# Altium schematic sheet USBLCD_driver.SchDoc
size A2
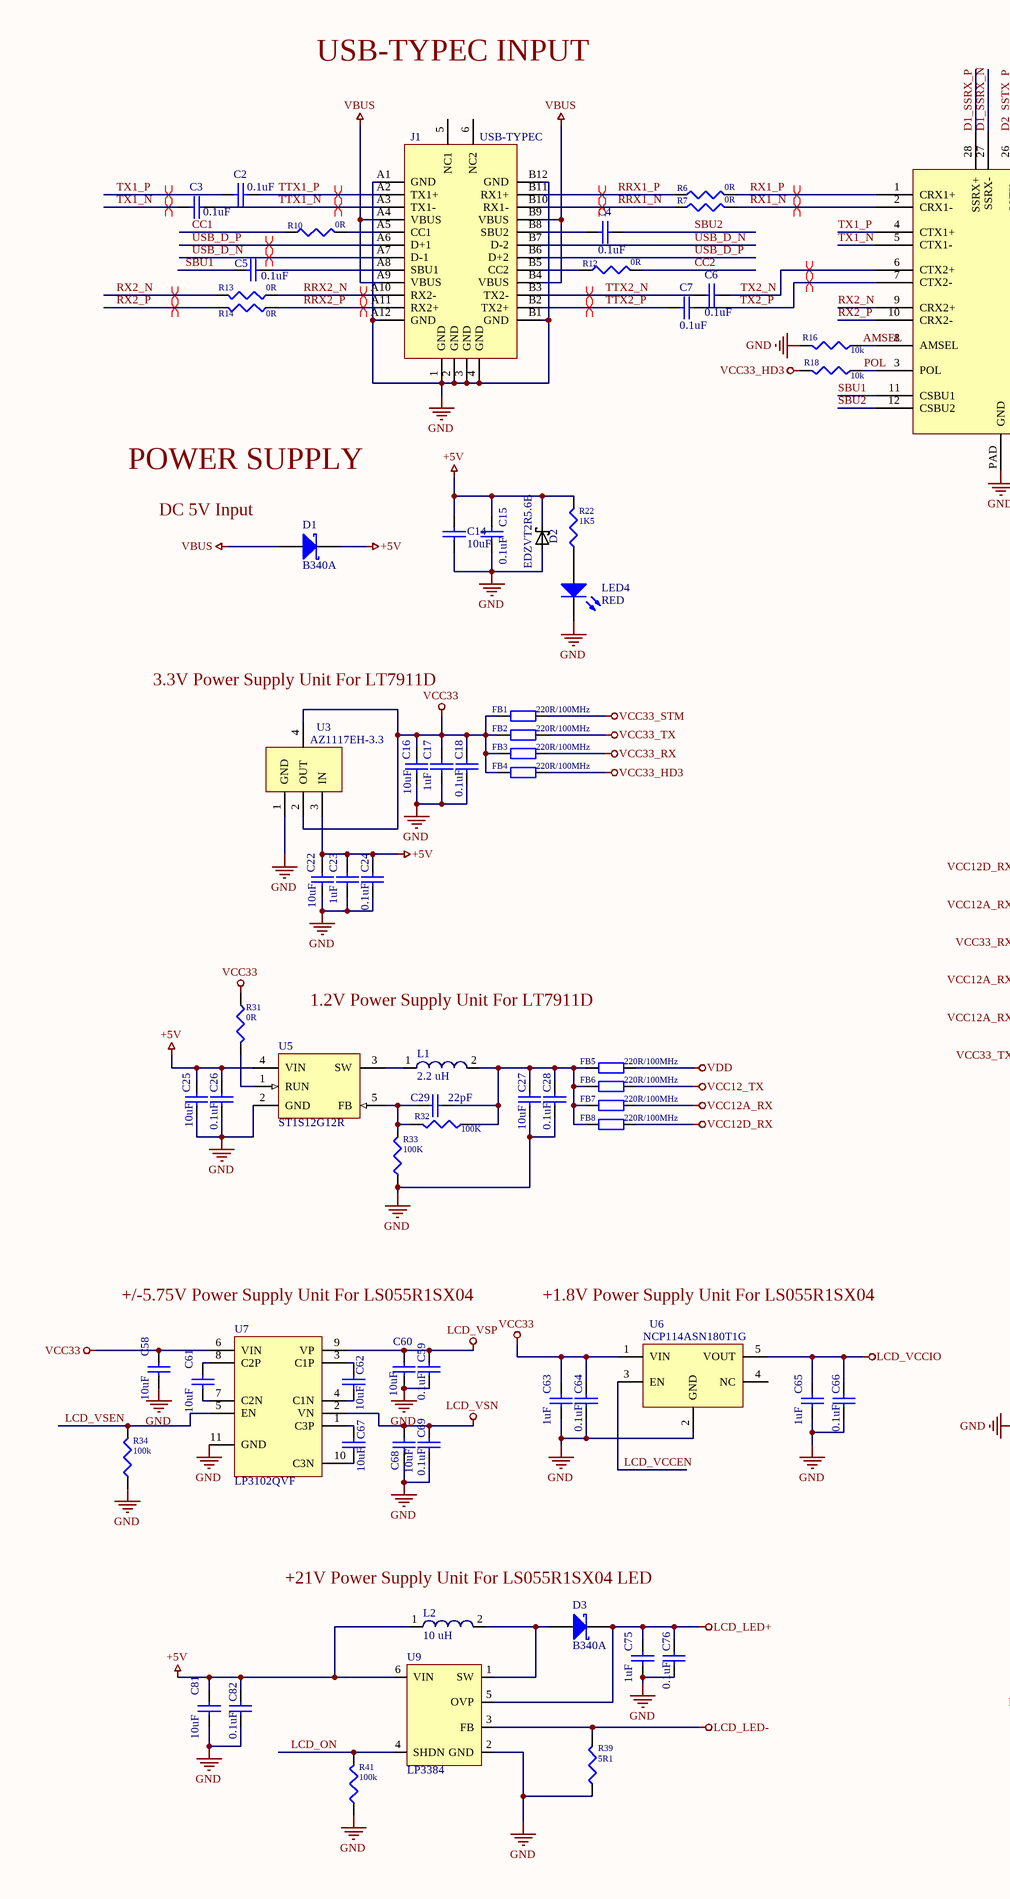
[diagram p0: USBLCD_driver.SchDoc, left]
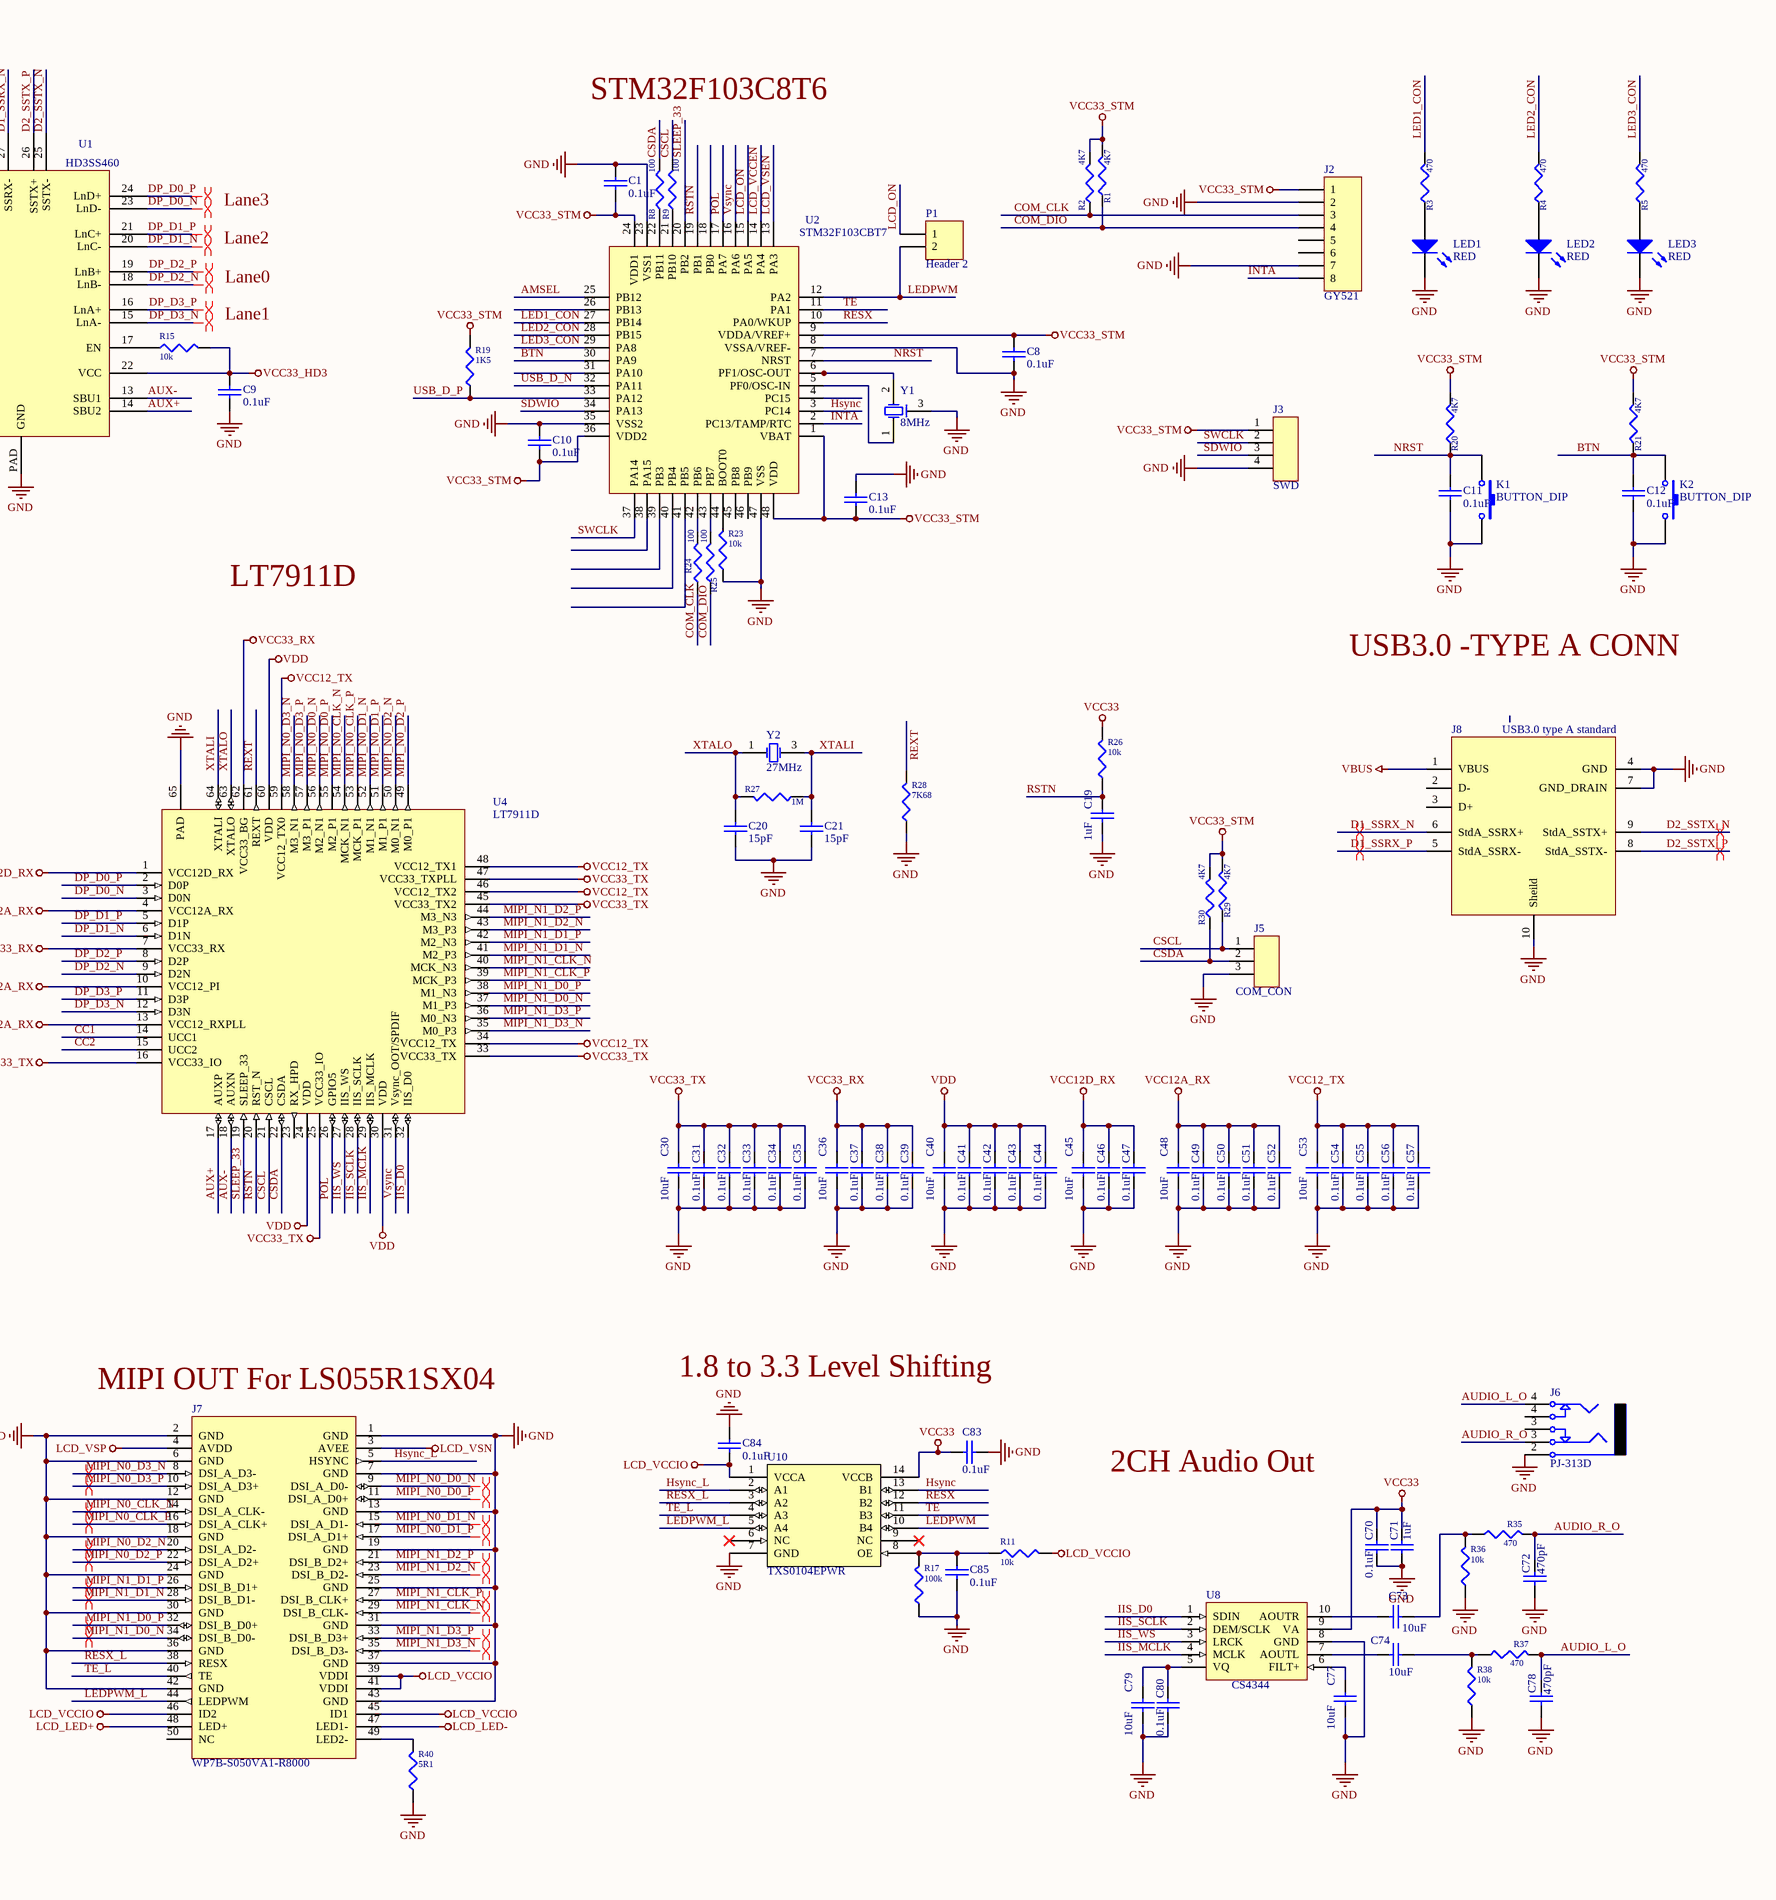
[diagram p1: USBLCD_driver.SchDoc, right]

## Parts
C1  0.1uF  [CAPACITOR_SMD_0402]
C2  0.1uF  [CAPACITOR_SMD_0201]
C3  0.1uF  [CAPACITOR_SMD_0201]
C4  0.1uF  [CAPACITOR_SMD_0201]
C5  0.1uF  [CAPACITOR_SMD_0201]
C6  0.1uF  [CAPACITOR_SMD_0201]
C7  0.1uF  [CAPACITOR_SMD_0201]
C8  0.1uF  [CAPACITOR_SMD_0402]
C9  0.1uF  [CAPACITOR_SMD_0402]
C10  0.1uF  [CAPACITOR_SMD_0402]
C11  0.1uF  [CAPACITOR_SMD_0402]
C12  0.1uF  [CAPACITOR_SMD_0402]
C13  0.1uF  [CAPACITOR_SMD_0402]
C14  10uF  [CAPACITOR_SMD_0603]
C15  0.1uF  [CAPACITOR_SMD_0402]
C16  10uF  [CAPACITOR_SMD_0603]
C17  1uF  [CAPACITOR_SMD_0402]
C18  0.1uF  [CAPACITOR_SMD_0402]
C19  1uF  [CAPACITOR_SMD_0402]
C20  15pF  [CAPACITOR_SMD_0402]
C21  15pF  [CAPACITOR_SMD_0402]
C22  10uF  [CAPACITOR_SMD_0603]
C23  1uF  [CAPACITOR_SMD_0402]
C24  0.1uF  [CAPACITOR_SMD_0402]
C25  10uF  [CAPACITOR_SMD_0603]
C26  0.1uF  [CAPACITOR_SMD_0402]
C27  10uF  [CAPACITOR_SMD_0603]
C28  0.1uF  [CAPACITOR_SMD_0402]
C29  22pF  [CAPACITOR_SMD_0402]
C30  10uF  [CAPACITOR_SMD_0603]
C31  0.1uF  [CAPACITOR_SMD_0402]
C32  0.1uF  [CAPACITOR_SMD_0402]
C33  0.1uF  [CAPACITOR_SMD_0402]
C34  0.1uF  [CAPACITOR_SMD_0402]
C35  0.1uF  [CAPACITOR_SMD_0402]
C36  10uF  [CAPACITOR_SMD_0603]
C37  0.1uF  [CAPACITOR_SMD_0402]
C38  0.1uF  [CAPACITOR_SMD_0402]
C39  0.1uF  [CAPACITOR_SMD_0402]
C40  10uF  [CAPACITOR_SMD_0603]
C41  0.1uF  [CAPACITOR_SMD_0402]
C42  0.1uF  [CAPACITOR_SMD_0402]
C43  0.1uF  [CAPACITOR_SMD_0402]
C44  0.1uF  [CAPACITOR_SMD_0402]
C45  10uF  [CAPACITOR_SMD_0603]
C46  0.1uF  [CAPACITOR_SMD_0402]
C47  0.1uF  [CAPACITOR_SMD_0402]
C48  10uF  [CAPACITOR_SMD_0603]
C49  0.1uF  [CAPACITOR_SMD_0402]
C50  0.1uF  [CAPACITOR_SMD_0402]
C51  0.1uF  [CAPACITOR_SMD_0402]
C52  0.1uF  [CAPACITOR_SMD_0402]
C53  10uF  [CAPACITOR_SMD_0603]
C54  0.1uF  [CAPACITOR_SMD_0402]
C55  0.1uF  [CAPACITOR_SMD_0402]
C56  0.1uF  [CAPACITOR_SMD_0402]
C57  0.1uF  [CAPACITOR_SMD_0402]
C58  10uF  [CAPACITOR_SMD_0603]
C59  0.1uF  [CAPACITOR_SMD_0402]
C60  10uF  [CAPACITOR_SMD_0603]
C61  10uF  [CAPACITOR_SMD_0603]
C62  10uF  [CAPACITOR_SMD_0603]
C63  1uF  [CAPACITOR_SMD_0402]
C64  0.1uF  [CAPACITOR_SMD_0402]
C65  1uF  [CAPACITOR_SMD_0402]
C66  0.1uF  [CAPACITOR_SMD_0402]
C67  10uF  [CAPACITOR_SMD_0603]
C68  10uF  [CAPACITOR_SMD_0603]
C69  0.1uF  [CAPACITOR_SMD_0402]
C70  0.1uF  [CAPACITOR_SMD_0402]
C71  1uF  [CAPACITOR_SMD_0402]
C72  470pF  [CAPACITOR_SMD_0402]
C73  10uF  [CAPACITOR_SMD_0603]
C74  10uF  [CAPACITOR_SMD_0603]
C75  1uF  [CAPACITOR_SMD_0402]
C76  0.1uF  [CAPACITOR_SMD_0402]
C77  10uF  [CAPACITOR_SMD_0603]
C78  470pF  [CAPACITOR_SMD_0402]
C79  10uF  [CAPACITOR_SMD_0603]
C80  0.1uF  [CAPACITOR_SMD_0402]
C81  10uF  [CAPACITOR_SMD_0603]
C82  0.1uF  [CAPACITOR_SMD_0402]
C83  0.1uF  [CAPACITOR_SMD_0402]
C84  0.1uF  [CAPACITOR_SMD_0402]
C85  0.1uF  [CAPACITOR_SMD_0402]
D1  B340A  [DO-214AC]
D2  EDZVT2R5.6B  [SOD128]
D3  B340A  [DO-214AC]
FB1  220R/100MHz  [SMD_0603]
FB2  220R/100MHz  [SMD_0603]
FB3  220R/100MHz  [SMD_0603]
FB4  220R/100MHz  [SMD_0603]
FB5  220R/100MHz  [SMD_0603]
FB6  220R/100MHz  [SMD_0603]
FB7  220R/100MHz  [SMD_0603]
FB8  220R/100MHz  [SMD_0603]
J1  USB-TYPEC  [USB_TYPEC_RECEPTACLE_DIP]
J2  GY521  [HDR1X8]
J3  SWD  [Header-Female-2.54*4]
J5  COM_CON  [Header-Female-2.54*3]
J6  PJ-313D  [WQP-PJ313D]
J7  WP7B-S050VA1-R8000  [WP7B-S050VA1-R500]
J8  USB3.0 type A standard  [USB type A female connector]
K1  BUTTON_DIP  [Push button_mini(2 pin)]
K2  BUTTON_DIP  [Push button_mini(2 pin)]
L1  2.2 uH  [WE-LQS 3015]
L2  10 uH  [WE-LQS 4018]
LED1  RED  [SMD_LED(0603)]
LED2  RED  [SMD_LED(0603)]
LED3  RED  [SMD_LED(0603)]
LED4  RED  [SMD_LED(0603)]
P1  Header 2  [HDR1X2]
R1  4K7  [RESISTOR_SMD_0402]
R2  4K7  [RESISTOR_SMD_0402]
R3  470  [RESISTOR_SMD_0402]
R4  470  [RESISTOR_SMD_0402]
R5  470  [RESISTOR_SMD_0402]
R6  0R  [RESISTOR_SMD_0201]
R7  0R  [RESISTOR_SMD_0201]
R8  100  [RESISTOR_SMD_0402]
R9  100  [RESISTOR_SMD_0402]
R10  0R  [RESISTOR_SMD_0201]
R11  10k  [RESISTOR_SMD_0402]
R12  0R  [RESISTOR_SMD_0201]
R13  0R  [RESISTOR_SMD_0201]
R14  0R  [RESISTOR_SMD_0201]
R15  10k  [RESISTOR_SMD_0402]
R16  10k  [RESISTOR_SMD_0402]
R17  100k  [RESISTOR_SMD_0402]
R18  10k  [RESISTOR_SMD_0402]
R19  1K5  [RESISTOR_SMD_0402]
R20  4K7  [RESISTOR_SMD_0402]
R21  4K7  [RESISTOR_SMD_0402]
R22  1K5  [RESISTOR_SMD_0402]
R23  10k  [RESISTOR_SMD_0402]
R24  100  [RESISTOR_SMD_0402]
R25  100  [RESISTOR_SMD_0402]
R26  10k  [RESISTOR_SMD_0402]
R27  1M  [RESISTOR_SMD_0402]
R28  7K68  [RESISTOR_SMD_0402]
R29  4K7  [RESISTOR_SMD_0402]
R30  4K7  [RESISTOR_SMD_0402]
R31  0R  [RESISTOR_SMD_0201]
R32  100K  [RESISTOR_SMD_0402]
R33  100K  [RESISTOR_SMD_0402]
R34  100k  [RESISTOR_SMD_0402]
R35  470  [RESISTOR_SMD_0402]
R36  10k  [RESISTOR_SMD_0402]
R37  470  [RESISTOR_SMD_0402]
R38  10k  [RESISTOR_SMD_0402]
R39  5R1  [RESISTOR_SMD_0402]
R40  5R1  [RESISTOR_SMD_0402]
R41  100k  [RESISTOR_SMD_0402]
U1  HD3SS460  [WQFN28-0.8mm]
U2  STM32F103CBT7  [LQFP48-7mm*7mm]
U3  AZ1117EH-3.3  [SOT223_N]
U4  LT7911D  [QFN64-7.5mm*7.5mm]
U5  ST1S12G12R  [SOT23 - 5]
U6  NCP114ASN180T1G  [SOT23 - 5]
U7  LP3102QVF  [TDFN-10]
U8  CS4344  [10LD TSSOP(3mm BODY)]
U9  LP3384  [SOT95P279X130-6N]
U10  TXS0104EPWR  [PW14]
Y1  8MHz  [Resonator_mini]
Y2  27MHz  [Crystal resonator]

## Nets
+5V: C14.1 C15.1 C22.1 C23.1 C24.1 C25.1 C26.1 C81.1 C82.1 D1.1(K) D2.1(K) L2.1 R22.2 U3.3(IN) U5.4(VIN) U9.6(VIN)
GND: C1.1 C8.2 C9.2 C10.1 C11.2 C12.2 C13.1 C14.2 C15.2 C16.2 C17.2 C18.2 C19.2 C20.2 C21.2 C22.2 C23.2 C24.2 C25.2 C26.2 C27.2 C28.2 C30.2 C31.2 C32.2 C33.2 C34.2 C35.2 C36.2 C37.2 C38.2 C39.2 C40.2 C41.2 C42.2 C43.2 C44.2 C45.2 C46.2 C47.2 C48.2 C49.2 C50.2 C51.2 C52.2 C53.2 C54.2 C55.2 C56.2 C57.2 C58.2 C59.2 C60.2 C63.2 C64.2 C65.2 C66.2 C68.2 C69.2 C70.2 C71.2 C72.2 C75.2 C76.2 C77.2 C78.2 C79.2 C80.2 C81.2 C82.2 C83.2 C84.2 C85.2 D2.2(A) J1.1(GND) J1.2(GND) J1.3(GND) J1.4(GND) J1.A1(GND) J1.A12(GND) J1.B1(GND) J1.B12(GND) J2.2 J2.7 J3.4 J5.3 J6.2 J7.1(GND) J7.2(GND) J7.6(GND) J7.7(GND) J7.12(GND) J7.13(GND) J7.18(GND) J7.19(GND) J7.24(GND) J7.25(GND) J7.30(GND) J7.31(GND) J7.36(GND) J7.37(GND) J7.42(GND) J7.43(GND) J8.4(GND) J8.7(GND_DRAIN) J8.10(Sheild) K1.2 K2.2 LED1.2(K) LED2.2(K) LED3.2(K) LED4.2(K) R16.2 R17.1 R23.1 R28.1 R33.1 R34.1 R36.1 R38.1 R39.1 R40.1 R41.1 U1.PAD(GND) U2.8(VSSA/VREF-) U2.23(VSS1) U2.35(VSS2) U2.47(VSS) U3.1(GND) U4.65(PAD) U5.2(GND) U6.2(GND) U7.11(GND) U8.8(GND) U9.2(GND) U10.7(GND) Y1.3(OSC2)
LCD_LED+: C75.1 C76.1 D3.1(K) J7.48(LED+) U9.5(OVP)
LCD_LED-: J7.47(LED1-) R39.2 U9.3(FB)
LCD_VCCIO: C65.1 C66.1 C84.1 J7.39(VDDI) J7.41(VDDI) J7.45(ID1) J7.46(ID2) R11.2 U6.5(VOUT) U10.1(VCCA)
LCD_VSN: C68.1 C69.1 J7.3(AVEE) U7.2(VN)
LCD_VSP: C59.1 C60.1 J7.4(AVDD) U7.9(VP)
VBUS: D1.2(A) J1.A4(VBUS) J1.A9(VBUS) J1.B4(VBUS) J1.B9(VBUS) J8.1(VBUS)
VCC12_TX: C53.1 C54.1 C55.1 C56.1 C57.1 FB6.2 U4.34(VCC12_TX) U4.46(VCC12_TX2) U4.48(VCC12_TX1) U4.59(VCC12_TX0)
VCC12A_RX: C48.1 C49.1 C50.1 C51.1 C52.1 FB7.2 U4.4(VCC12A_RX) U4.10(VCC12_PI) U4.13(VCC12_RXPLL)
VCC12D_RX: C45.1 C46.1 C47.1 FB8.2 U4.1(VCC12D_RX)
VCC33: C16.1 C17.1 C18.1 C58.1 C63.1 C64.1 C70.1 C71.1 C83.1 FB1.1 FB2.1 FB3.1 FB4.1 R26.2 R31.1 U3.2(OUT) U3.4(OUT) U6.1(VIN) U7.6(VIN) U8.9(VA) U10.14(VCCB)
VCC33_HD3: C9.1 FB4.2 R15.2 R18.2 U1.22(VCC)
VCC33_RX: C36.1 C37.1 C38.1 C39.1 FB3.2 U4.7(VCC33_RX) U4.62(VCC33_BG)
VCC33_STM: C1.2 C8.1 C10.2 C13.2 FB1.2 J2.1 J3.1 R1.2 R2.2 R19.2 R20.2 R21.2 R29.2 R30.2 U2.1(VBAT) U2.9(VDDA/VREF+) U2.24(VDD1) U2.36(VDD2) U2.48(VDD)
VCC33_TX: C30.1 C31.1 C32.1 C33.1 C34.1 C35.1 FB2.2 U4.16(VCC33_IO) U4.25(VCC33_IO) U4.33(VCC33_TX) U4.45(VCC33_TX2) U4.47(VCC33_TXPLL)
VDD: C40.1 C41.1 C42.1 C43.1 C44.1 FB5.2 U4.24(VDD) U4.30(VDD) U4.60(VDD)
AMSEL: R16.1 U1.8(AMSEL) U2.25(PB12)
AUDIO_L_O: C78.1 J6.4 R37.2
AUDIO_R_O: C72.1 J6.3 R35.2
AUX+: U1.14(SBU2) U4.17(AUXP)
AUX-: U1.13(SBU1) U4.18(AUXN)
BTN: C12.1 K2.1 R21.1 U2.30(PA9)
CC1: R10.1 U4.14(UCC1)
CC2: R12.2 U4.15(UCC2)
COM_CLK: J2.3 R2.1 R24.1
COM_DIO: J2.4 R1.1 R25.1
CSCL: J5.1 R9.2 R29.1 U4.21(CSCL)
CSDA: J5.2 R8.2 R30.1 U4.22(CSDA)
D1_SSRX_N: J8.6(StdA_SSRX+) U1.27(SSRX-)
D1_SSRX_P: J8.5(StdA_SSRX-) U1.28(SSRX+)
D2_SSTX_N: J8.9(StdA_SSTX+) U1.25(SSTX-)
D2_SSTX_P: J8.8(StdA_SSTX-) U1.26(SSTX+)
DP_D0_N: U1.23(LnD-) U4.3(D0N)
DP_D0_P: U1.24(LnD+) U4.2(D0P)
DP_D1_N: U1.20(LnC-) U4.6(D1N)
DP_D1_P: U1.21(LnC+) U4.5(D1P)
DP_D2_N: U1.18(LnB-) U4.9(D2N)
DP_D2_P: U1.19(LnB+) U4.8(D2P)
DP_D3_N: U1.15(LnA-) U4.12(D3N)
DP_D3_P: U1.16(LnA+) U4.11(D3P)
Hsync: U2.3(PC14) U10.13(B1)
Hsync_L: J7.5(HSYNC) U10.2(A1)
IIS_D0: U4.32(IIS_D0) U8.1(SDIN)
IIS_MCLK: U4.29(IIS_MCLK) U8.4(MCLK)
IIS_SCLK: U4.28(IIS_SCLK) U8.2(DEM/SCLK)
IIS_WS: U4.27(IIS_WS) U8.3(LRCK)
INTA: J2.8 U2.2(PC13/TAMP/RTC)
LCD_ON: P1.1 R41.2 U2.15(PA5) U9.4(SHDN)
LCD_VCCEN: U2.14(PA4) U6.3(EN)
LCD_VSEN: R34.2 U2.13(PA3) U7.5(EN)
LED1_CON: R3.2 U2.27(PB14)
LED2_CON: R4.2 U2.28(PB15)
LED3_CON: R5.2 U2.29(PA8)
LEDPWM: P1.2 U2.12(PA2) U10.10(B4)
LEDPWM_L: J7.44(LEDPWM) U10.5(A4)
MIPI_N0_CLK_N: J7.14(DSI_A_CLK-) U4.54(MCK_N1)
MIPI_N0_CLK_P: J7.16(DSI_A_CLK+) U4.53(MCK_P1)
MIPI_N0_D0_N: J7.9(DSI_A_D0-) U4.56(M2_N1)
MIPI_N0_D0_P: J7.11(DSI_A_D0+) U4.55(M2_P1)
MIPI_N0_D1_N: J7.15(DSI_A_D1-) U4.52(M1_N1)
MIPI_N0_D1_P: J7.17(DSI_A_D1+) U4.51(M1_P1)
MIPI_N0_D2_N: J7.20(DSI_A_D2-) U4.50(M0_N1)
MIPI_N0_D2_P: J7.22(DSI_A_D2+) U4.49(M0_P1)
MIPI_N0_D3_N: J7.8(DSI_A_D3-) U4.58(M3_N1)
MIPI_N0_D3_P: J7.10(DSI_A_D3+) U4.57(M3_P1)
MIPI_N1_CLK_N: J7.29(DSI_B_CLK-) U4.40(MCK_N3)
MIPI_N1_CLK_P: J7.27(DSI_B_CLK+) U4.39(MCK_P3)
MIPI_N1_D0_N: J7.34(DSI_B_D0-) U4.37(M1_P3)
MIPI_N1_D0_P: J7.32(DSI_B_D0+) U4.38(M1_N3)
MIPI_N1_D1_N: J7.28(DSI_B_D1-) U4.41(M2_P3)
MIPI_N1_D1_P: J7.26(DSI_B_D1+) U4.42(M2_N3)
MIPI_N1_D2_N: J7.23(DSI_B_D2-) U4.43(M3_P3)
MIPI_N1_D2_P: J7.21(DSI_B_D2+) U4.44(M3_N3)
MIPI_N1_D3_N: J7.35(DSI_B_D3-) U4.35(M0_P3)
MIPI_N1_D3_P: J7.33(DSI_B_D3+) U4.36(M0_N3)
NRST: C11.1 K1.1 R20.1 U2.7(NRST)
POL: R18.1 U1.3(POL) U2.17(PA7) U4.26(GPIO5)
RESX: U2.10(PA0/WKUP) U10.12(B2)
RESX_L: J7.38(RESX) U10.3(A2)
REXT: R28.2 U4.61(REXT)
RRX1_N: J1.B10(RX1-) R7.1
RRX1_P: J1.B11(RX1+) R6.1
RRX2_N: J1.A10(RX2-) R13.1
RRX2_P: J1.A11(RX2+) R14.1
RSTN: C19.1 R26.1 U2.19(PB1) U4.20(RST_N)
RX1_N: R7.2 U1.2(CRX1-)
RX1_P: R6.2 U1.1(CRX1+)
RX2_N: R13.2 U1.9(CRX2+)
RX2_P: R14.2 U1.10(CRX2-)
SBU1: C5.2 U1.11(CSBU1)
SBU2: C4.1 U1.12(CSBU2)
SDWIO: J3.3 U2.34(PA13)
SLEEP_33: U2.20(PB2) U4.19(SLEEP_33)
SWCLK: J3.2 U2.37(PA14)
TE: U2.11(PA1) U10.11(B3)
TE_L: J7.40(TE) U10.4(A3)
TTX1_N: C3.1 J1.A3(TX1-)
TTX1_P: C2.1 J1.A2(TX1+)
TTX2_N: C6.2 J1.B3(TX2-)
TTX2_P: C7.2 J1.B2(TX2+)
TX1_N: C3.2 U1.5(CTX1-)
TX1_P: C2.2 U1.4(CTX1+)
TX2_N: C6.1 U1.6(CTX2+)
TX2_P: C7.1 U1.7(CTX2-)
USB_D_N: J1.A7(D-1) J1.B7(D-2) U2.32(PA11)
USB_D_P: J1.A6(D+1) J1.B6(D+2) R19.1 U2.33(PA12)
Vsync: U2.16(PA6) U4.31(Vsync_OOT/SPDIF)
XTALI: C21.1 R27.1 U4.64(XTALI) Y2.3(OSC2)
XTALO: C20.1 R27.2 U4.63(XTALO) Y2.1(OSC1)
NetC4_2: C4.2 J1.B8(SBU2)
NetC5_1: C5.1 J1.A8(SBU1)
NetC27_1: C27.1 C28.1 C29.2 FB5.1 FB6.1 FB7.1 FB8.1 L1.2 R32.1
NetC29_1: C29.1 R32.2 R33.2 U5.5(FB)
NetC61_1: C61.1 U7.8(C2P)
NetC61_2: C61.2 U7.7(C2N)
NetC62_1: C62.1 U7.3(C1P)
NetC62_2: C62.2 U7.4(C1N)
NetC67_1: C67.1 U7.1(C3P)
NetC67_2: C67.2 U7.10(C3N)
NetC73_1: C73.1 U8.10(AOUTR)
NetC73_2: C73.2 R35.1 R36.2
NetC74_1: C74.1 U8.7(AOUTL)
NetC74_2: C74.2 R37.1 R38.2
NetC77_1: C77.1 U8.6(FILT+)
NetC79_1: C79.1 C80.1 U8.5(VQ)
NetC85_1: C85.1 R11.1 R17.2 U10.8(OE)
NetD3_2: D3.2(A) L2.2 U9.1(SW)
NetJ1_A5: J1.A5(CC1) R10.2
NetJ1_B5: J1.B5(CC2) R12.1
NetJ7_49: J7.49(LED2-) R40.2
NetL1_1: L1.1 U5.3(SW)
NetLED1_1: LED1.1(A) R3.1
NetLED2_1: LED2.1(A) R4.1
NetLED3_1: LED3.1(A) R5.1
NetLED4_1: LED4.1(A) R22.1
NetR8_1: R8.1 U2.22(PB11)
NetR9_1: R9.1 U2.21(PB10)
NetR15_1: R15.1 U1.17(EN)
NetR23_2: R23.2 U2.44(BOOT0)
NetR24_2: R24.2 U2.42(PB6)
NetR25_2: R25.2 U2.43(PB7)
NetR31_2: R31.2 U5.1(RUN)
NetU2_5: U2.5(PF0/OSC-IN) Y1.1(OSC1)
NetU2_6: U2.6(PF1/OSC-OUT) Y1.2(OSC2)

Not connected (* = marked no-connect by the designer): J1 5(NC1) 6(NC2); J2 5 6; J7 50(NC); J8 2(D-) 3(D+); U2 4(PC15) 18(PB0) 26(PB13) 31(PA10) 38(PA15) 39(PB3) 40(PB4) 41(PB5) 45(PB8) 46(PB9); U4 23(RX_HPD); U6 4(NC); U10 6(NC)* 9(NC)*

## Layout directives
differential pair: D1_SSRX_N, D1_SSRX_P, D2_SSTX_N, D2_SSTX_P, DP_D0_N, DP_D0_P, DP_D1_N, DP_D1_P, DP_D2_N, DP_D2_P, DP_D3_N, DP_D3_P, MIPI_N0_CLK_N, MIPI_N0_CLK_P, MIPI_N0_D0_N, MIPI_N0_D0_P, MIPI_N0_D1_N, MIPI_N0_D1_P, MIPI_N0_D2_N, MIPI_N0_D2_P, MIPI_N0_D3_N, MIPI_N0_D3_P, MIPI_N1_CLK_N, MIPI_N1_CLK_P, MIPI_N1_D0_N, MIPI_N1_D0_P, MIPI_N1_D1_N, MIPI_N1_D1_P, MIPI_N1_D2_N, MIPI_N1_D2_P, MIPI_N1_D3_N, MIPI_N1_D3_P, RRX1_N, RRX1_P, RRX2_N, RRX2_P, RX1_N, RX1_P, RX2_N, RX2_P, TTX1_N, TTX1_P, TTX2_N, TTX2_P, TX1_N, TX1_P, TX2_N, TX2_P, USB_D_N, USB_D_P

## Notes on the sheet
- USB-TYPEC INPUT
- STM32F103C8T6
- Lane3
- Lane2
- Lane0
- (near R15) Lane1
- POWER SUPPLY
- DC 5V Input
- LT7911D
- 3.3V Power Supply Unit For LT7911D
- USB3.0 -TYPE A CONN
- 1.2V Power Supply Unit For LT7911D
- +/-5.75V Power Supply Unit For LS055R1SX04
- +1.8V Power Supply Unit For LS055R1SX04
- (near J7) MIPI OUT For LS055R1SX04
- 1.8 to 3.3 Level Shifting
- 2CH Audio Out
- +21V Power Supply Unit For LS055R1SX04 LED

## Library data of the parts
C1 C8-C13 C15 C18 C24 C26 C28 C31-C35 C37-C39 C41-C44 C46 C47 C49-C52 C54-C57 C59 C64 C66 C69 C70 C76 C80 C82-C85 = CAP_0402_100n: CAP CER 0.1UF 16V X7R 0402; Manufacturer: Murata Electronics North America; Manufacturer Part Number: GRM155R71C104KA88D; Digikey Code: 490-3261-1-ND; Value: 0.1uF
C2-C7 = CAP_0201_100n: CAP CER 0.1UF 10V X5R 0201; Manufacturer: Murata Electronics North America; Manufacturer Part Number: GRM033R61A104KE15D; Digikey Code: 490-5881-1-ND; Value: 0.1uF
C14 C16 C22 C25 C27 C30 C36 C40 C45 C48 C53 C58 C60-C62 C67 C68 C73 C74 C77 C79 C81 = CAP_0603_1u: CAP CER 1UF 16V X5R 0603; Manufacturer: Murata Electronics North America; Manufacturer Part Number: GRM188R61C105KA12D; Digikey Code: 490-10479-1-ND; Value: 10uF
C17 C19-C21 C23 C29 C63 C65 C71 C72 C75 C78 = CAP_0402_10u: CAP CER 10UF 4V X5R 0402; Manufacturer: Murata Electronics North America; Manufacturer Part Number: GRM155R60G106ME44D; Digikey Code: 490-10693-1-ND
  C17 C19 C23 C63 C65 C71 C75: Value: 1uF
  C20 C21: Value: 15pF
  C29: Value: 22pF
  C72 C78: Value: 470pF
D1 D3 = Diode 10TQ035: Schottky Rectifier; Note: Terminal 2 is the TAB and is electrically connected to the cathode; Published: 8-Jun-2000; LatestRevisionDate: 17-Jul-2002; LatestRevisionNote: Re-released for DXP Platform.; DatasheetVersion: PD-2.057B; PackageVersion: Feb-1998; PackageReference: TO-220AC; Publisher: Altium Limited; PackageDescription: TO, Thru-Hole, Vertical, Heatsink Mounted; 3 In-Line Leads (1 Absent); Pitch 2.54 mm; ComponentLink1Description: Manufacturer Link; ComponentLink1URL: http://www.irf.com/; ComponentLink2Description: Datasheet; ComponentLink2URL: http://www.irf.com/product-info/datasheets/data/10tq.pdf
D2 = BAT46W: MF: Diotec; Availability: Unavailable; SnapEDA_Link: https://www.snapeda.com/parts/BAT46W/Diotec/view-part/?ref=snap; MP: BAT46W; Price: None; Package: SOD-123 Diotec; Value: *
FB1-FB8 = Res2: Ferrite Bead(0603); Published: 8-Jun-2000; LatestRevisionDate: 17-Jul-2002; LatestRevisionNote: Re-released for DXP Platform.; PackageReference: AXIAL-0.4; Publisher: Altium Limited; PackageDescription: Axial Device, Thru-Hole; 2 Leads; 0.4 in Pin Spacing
J1 = USB-TYPEC: USB-TYPE C Receptable DIP Connector
J2 = Header 8: Header, 8-Pin; LatestRevisionDate: 17-Jul-2002; LatestRevisionNote: Re-released for DXP Platform.; Publisher: Altium Limited
J3 = 4PinConnector
J5 = 3PinConnector
J6 = WPQ-PJ313D: Connector, 3.5mm Stereo Audio Socket, Black
J7 = LS055R1SX04: WP7B-S050VA1-R8000 / LCD Connector for LS055R1SX04
J8 = USB3.0 type A standard: 9Pin DIP USB3.0 type A female Connector
K1 K2 = SW-PB: 2 Pin Mini Push Button Switch; Published: 24-Mar-1999; LatestRevisionDate: 17-Jul-2002; LatestRevisionNote: Re-released for DXP Platform.; PackageReference: SPST-2; Publisher: Altium Limited; PackageDescription: Switch; 2 Leads
L1 = CMP-1354-00022-1: SMD Power Inductor, L=2.2 µH 1.5A 72mOhm; PartNumber: NR3015T2R2M; Manufacturer: Taiyo Yuden; Inductance: 2.2 ÂµH; ComponentLink2URL: http://katalog.we-online.de/pbs/datasheet/74404032022.pdf; ComponentLink1URL: http://www.we-online.com; ComponentLink2Description: Datasheet; ComponentLink1Description: Manufacturer URL; PackageReference: WE-LQS 3015
L2 = CMP-1354-00028-1: WE-LQS SMD Power Inductor, L=10 µH; PartNumber: NRS4018T100MDGJ; Manufacturer: Taiyo Yuden; Inductance: 10 ÂµH; ComponentLink2URL: http://katalog.we-online.de/pbs/datasheet/74404042100.pdf; ComponentLink2Description: Datasheet; PackageReference: WE-LQS 4018; ComponentLink1URL: http://www.we-online.com; ComponentLink1Description: Manufacturer URL
LED1-LED4 = LED1: Typical RED GaAs LED; Published: Yellow; LatestRevisionDate: 08-Jul-2005; LatestRevisionNote: Mech Layer 1 removed.; PackageReference: LED-1; Publisher: Altium Limited; PackageDescription: LED; 2 Leads
P1 = Header 2: Header, 2-Pin; LatestRevisionDate: 17-Jul-2002; LatestRevisionNote: Re-released for DXP Platform.; Publisher: Altium Limited
R1-R5 R8 R9 R11 R15-R30 R32-R38 R41 = RES_0402_3K3: RES SMD 3.3K OHM 1% 1/10W 0402; Manufacturer: Panasonic Electronic Components; Manufacturer Part Number: ERJ-2RKF3301X; Digikey Code: P3.30KLTR-ND
  R1 R2 R20 R21 R29 R30: Value: 4K7
  R3-R5 R35 R37: Value: 470
  R8 R9 R24 R25: Value: 100
  R11 R15 R16 R18 R23 R26 R36 R38: Value: 10k
  R17 R34 R41: Value: 100k
  R19 R22: Value: 1K5
  R27: Value: 1M
  R28: Value: 7K68
  R32 R33: Value: 100K
R6 R7 R10 R12-R14 R31 = RES_0201_10R: RES SMD 10 OHM 1% 1/20W 0201; Manufacturer: Panasonic Electronic Components; Manufacturer Part Number: ERJ-1GEF10R0C; Digikey Code: P10.0ABCT-ND; Value: 0R
R39 R40 = RES_0402_499K: RES SMD 49.9K OHM 1% 1/10W 0402; Manufacturer: Panasonic Electronic Components; Manufacturer Part Number: ERJ-2RKF4993X; Digikey Code: P499KLCT-ND; Value: 5R1
U1 = HDS3SS460: 4 x 6 Channels USB Type-C Alternate Mode MUX
U2 = STM32F303CBT7: 32bit MCU
U3 = AMS1117-3.3V: 3.3V Voltage Regulator
U4 = LT7911D: USB/MIPI port converter
U5 = TD6810: voltage regulater; Published: 8-Jun-2000; LatestRevisionDate: 17-Jul-2002; LatestRevisionNote: Re-released for DXP Platform.; DatasheetVersion: REV. B; PackageVersion: 1990; PackageReference: H-08A; Publisher: Altium Limited; PackageDescription: Can; 8 Leads; Pin Circle Dia. 5.08 mm; Lead Dia. 0.53 mm (max); ComponentLink1Description: Manufacturer Link; ComponentLink1URL: http://www.analog.com/
U6 = NCP718BSN180T1G: 1.8V LDO Voltage Regulator
U7 = LP3102QVP: Dual channel charge pump power solution For TFT LCD Panel; Published: 8-Jun-2000; LatestRevisionDate: 17-Jul-2002; LatestRevisionNote: Re-released for DXP Platform.; DatasheetVersion: REV. B; PackageVersion: 1990; PackageReference: H-08A; Publisher: Altium Limited; PackageDescription: Can; 8 Leads; Pin Circle Dia. 5.08 mm; Lead Dia. 0.53 mm (max); ComponentLink1Description: Manufacturer Link; ComponentLink1URL: http://www.analog.com/
U8 = CS4344: Stereo D/A Converter; Published: 8-Jun-2000; LatestRevisionDate: 17-Jul-2002; LatestRevisionNote: Re-released for DXP Platform.; DatasheetVersion: REV. B; PackageVersion: 1990; PackageReference: H-08A; Publisher: Altium Limited; PackageDescription: Can; 8 Leads; Pin Circle Dia. 5.08 mm; Lead Dia. 0.53 mm (max); ComponentLink1Description: Manufacturer Link; ComponentLink1URL: http://www.analog.com/
U9 = SOT23
U10 = TXS0104E: Voltage Level Translator Bidirectional 1 Circuit 4 Channel 24Mbps 14-TSSOP
Y1 = XTAL: Crystal Oscillator; Published: 8-Jun-2000; LatestRevisionDate: 17-Jul-2002; LatestRevisionNote: Re-released for DXP Platform.; PackageReference: R38; Publisher: Altium Limited; PackageDescription: Crystal, Thru-Hole; 2 Leads; Body 3.1 x 8.2 mm (Dia.xH)
Y2 = XTAL_2: Crystal Oscillator; Published: 8-Jun-2000; LatestRevisionDate: 17-Jul-2002; LatestRevisionNote: Re-released for DXP Platform.; PackageReference: R38; Publisher: Altium Limited; PackageDescription: Crystal, Thru-Hole; 2 Leads; Body 3.1 x 8.2 mm (Dia.xH)